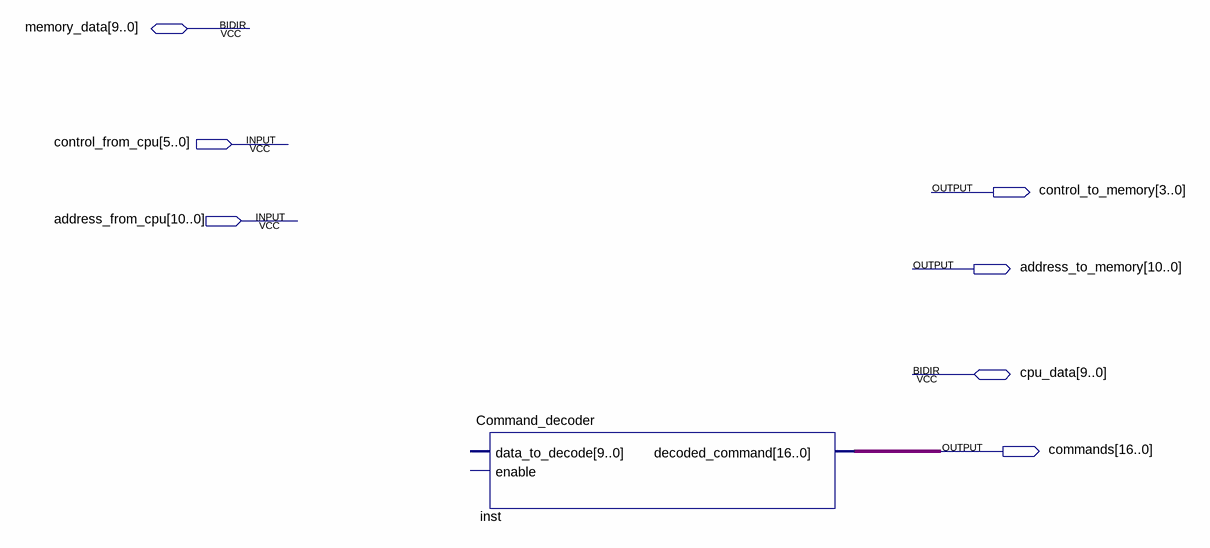
[diagram p0: schematic sheet]
// Quartus schematic Cash_Decoder.bdf as structural Verilog: 1 symbols, 7 pins
module Cash_Decoder (
  input  [5:0] control_from_cpu,
  input  [10:0] address_from_cpu,
  inout  [9:0] memory_data,
  inout  [9:0] cpu_data,
  output [3:0] control_to_memory,
  output [10:0] address_to_memory,
  output [16:0] commands
);

  Command_decoder inst (.decoded_command(commands));  // open: data_to_decode, enable
endmodule
